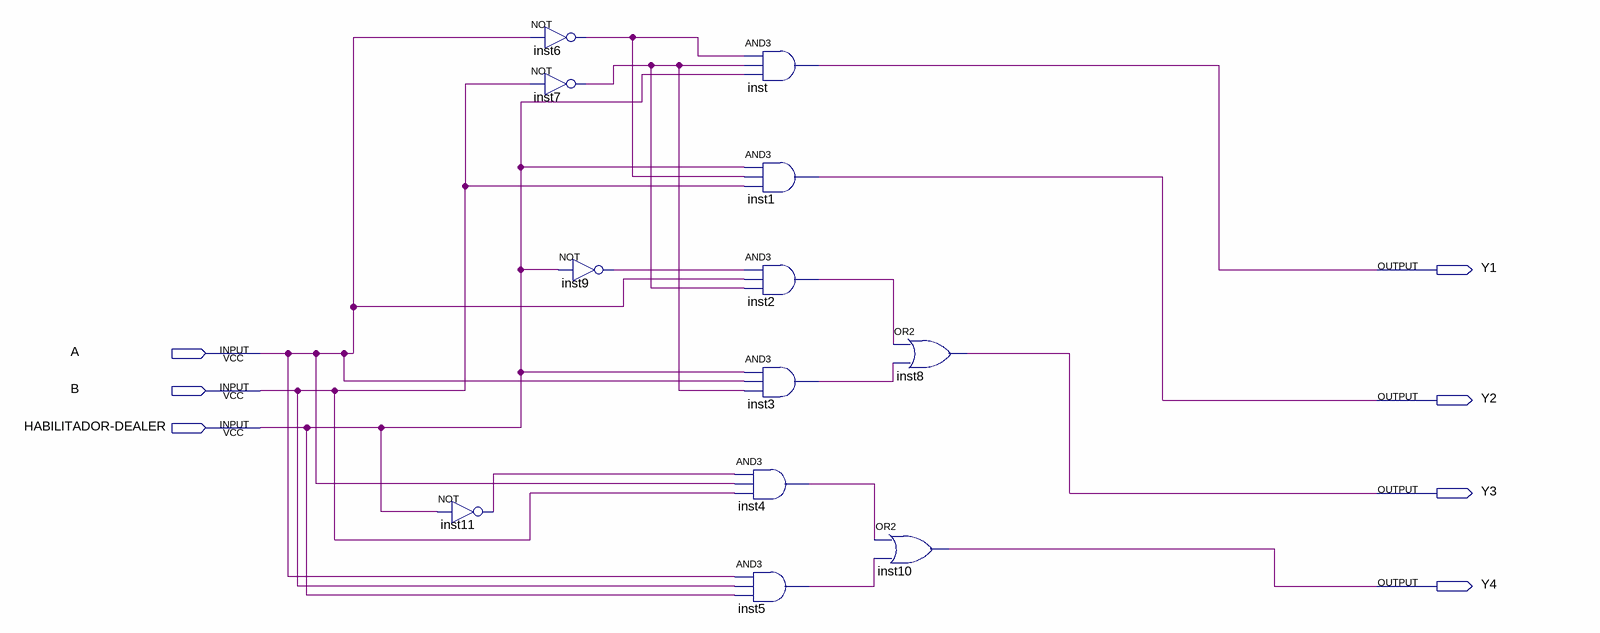
[diagram p0: schematic sheet]
// Quartus schematic decoderSelecao7seg.bdf as structural Verilog: 12 symbols, 7 pins
module decoderSelecao7seg (
  input  A,
  input  B,
  input  \HABILITADOR-DEALER ,
  output Y1,
  output Y2,
  output Y3,
  output Y4
);

  wire inst2_out, inst3_out, inst4_out, inst5_out, inst6_out, inst7_out, inst9_out, inst11_out;

  not inst11 (inst11_out, \HABILITADOR-DEALER );
  not inst6 (inst6_out, A);
  not inst7 (inst7_out, B);
  not inst9 (inst9_out, \HABILITADOR-DEALER );
  and inst (Y1, inst6_out, inst7_out, \HABILITADOR-DEALER );
  and inst1 (Y2, \HABILITADOR-DEALER , inst6_out, B);
  and inst2 (inst2_out, inst9_out, A, inst7_out);
  and inst3 (inst3_out, \HABILITADOR-DEALER , A, inst7_out);
  and inst4 (inst4_out, inst11_out, A, B);
  and inst5 (inst5_out, A, B, \HABILITADOR-DEALER );
  or inst8 (Y3, inst2_out, inst3_out);
  or inst10 (Y4, inst4_out, inst5_out);
endmodule
